# EAGLE design main (EAGLE 9.3.0)
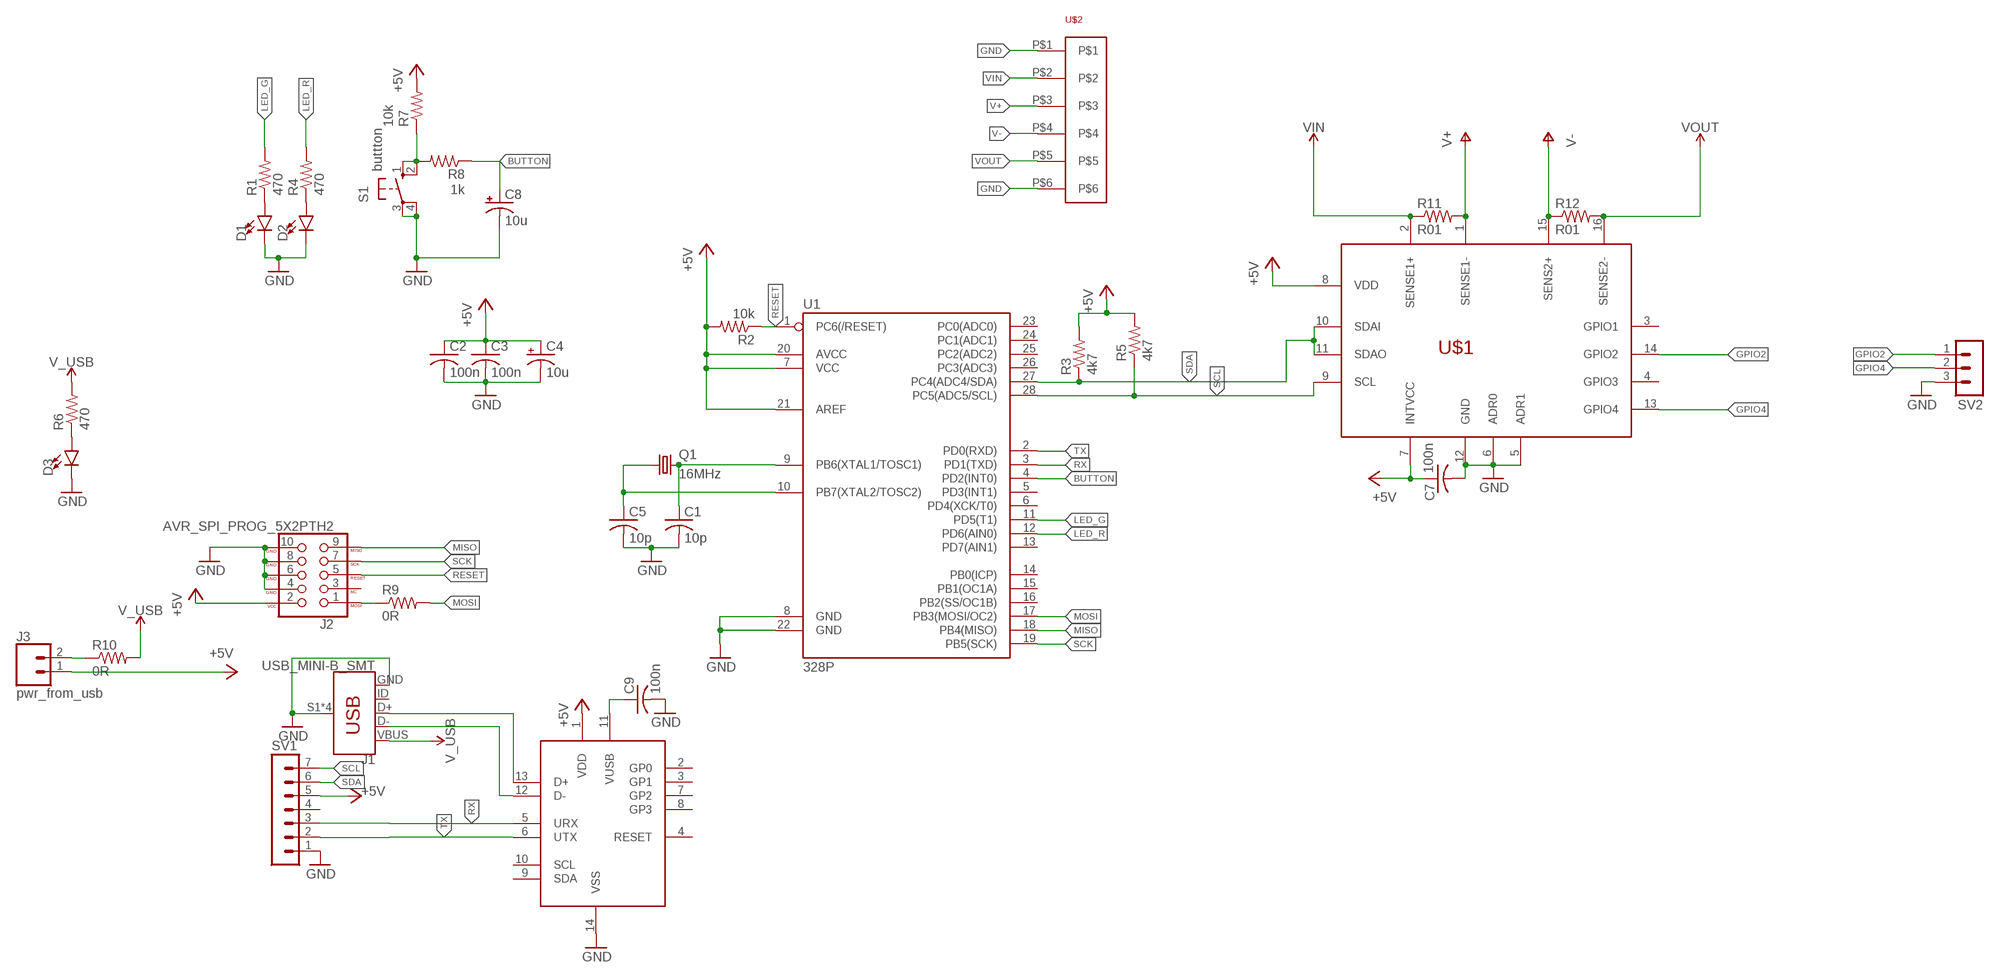
[diagram p0: schematic, sheet 1]

## Parts
BR1  MCP2221A  [DIP14]
C1  10p  C-USC0603  [C0603]
C2  100n  C-US050-030X075  [C050-030X075]
C3  100n  C-USC0805  [C0805]
C4  10u  CPOL-USE2,5-6E  [E2,5-6E]
C5  10p  C-USC0603  [C0603]
C7  100n  C-USC0805  [C0805]
C8  10u  CPOL-USE5-5  [E5-5]
C9  100n  C-US050-030X075  [C050-030X075]
D1  LED3MM  [LED_3MM]
D2  LED3MM  [LED_3MM]
D3  LED3MM  [LED_3MM]
J1  USB_MINI-B_SMT  [USB-MINIB]
J2  AVR_SPI_PROG_5X2PTH2  [2X5-SHROUDED]
J3  pwr_from_usb  CONN_02  [1X02]
Q1  16MHz  CRYSTALHC49U70  [HC49U70]
R1  470  R-US_R0805  [R0805]
R2  10k  R-US_0204/7  [0204/7]
R3  4k7  R-US_0207/10  [0207/10]
R4  470  R-US_R0805  [R0805]
R5  4k7  R-US_0207/10  [0207/10]
R6  470  R-US_R0805  [R0805]
R7  10k  R-US_R0805  [R0805]
R8  1k  R-US_R0805  [R0805]
R9  0R  R-US_0204/7  [0204/7]
R10  0R  R-US_0207/15  [0207/15]
R11  R01  R-US_R2512  [R2512]
R12  R01  R-US_R2512  [R2512]
S1  buttton  10-XX  [B3F-10XX]
SV1  MA07-1  [MA07-1]
SV2  MA03-1  [MA03-1]
U1  328P  ATMEGA328P_PDIP  [DIP28]
U$1  LTC2992  [MSOP16]
U$2  SCREWTERM_5MM_6WAY  [SCREWTERM_5MM_6WAY]

## Nets
+5V: BR1.1(VDD) C2.1 C3.1 C4.+ C7.1 J2.2(VCC) J3.1 R2.2 R3.2 R5.2 R7.2 SV1.5 U1.7(VCC) U1.20(AVCC) U1.21(AREF) U$1.7(INTVCC) U$1.8(VDD)
BUTTON: C8.+ R8.1 U1.4(PD2(INT0))
GND: BR1.14(VSS) C1.2 C2.2 C3.2 C4.- C5.2 C7.2 C8.- C9.2 D1.K(C) D2.K(C) D3.K(C) J1.GND J1.S1(SHIELD) J1.S2(SHIELD) J1.S3(SHIELD) J1.S4(SHIELD) J2.4(GND) J2.6(GND) J2.8(GND) J2.10(GND) S1.3(P) S1.4(P1) SV1.1 SV2.3 U1.8(GND) U1.22(GND) U$1.5(ADR1) U$1.6(ADR0) U$1.12(GND) U$2.P$1 U$2.P$6
GPIO2: SV2.1 U$1.14(GPIO2)
GPIO4: SV2.2 U$1.13(GPIO4)
LED_G: R1.2 U1.11(PD5(T1))
LED_R: R4.2 U1.12(PD6(AIN0))
MISO: J2.9(MISO) U1.18(PB4(MISO))
MOSI: R9.2 U1.17(PB3(MOSI/OC2))
N$1: C1.1 Q1.2 U1.9(PB6(XTAL1/TOSC1))
N$2: C5.1 Q1.1 U1.10(PB7(XTAL2/TOSC2))
N$3: D3.A R6.1
N$4: BR1.13(D+) J1.D+
N$5: BR1.12(D-) J1.D-
N$6: D2.A R4.1
N$7: R7.1 R8.2 S1.1(S) S1.2(S1)
N$8: D1.A R1.1
N$9: J2.1(MOSI) R9.1
N$10: BR1.11(VUSB) C9.1
N$11: J3.2 R10.1
RESET: J2.5(RESET) R2.1 U1.1(PC6(/RESET))
RX: BR1.5(URX) SV1.3 U1.3(PD1(TXD))
SCK: J2.7(SCK) U1.19(PB5(SCK))
SCL: R5.1 SV1.7 U1.28(PC5(ADC5/SCL)) U$1.9(SCL)
SDA: R3.1 SV1.6 U1.27(PC4(ADC4/SDA)) U$1.10(SDAI) U$1.11(SDAO)
TX: BR1.6(UTX) SV1.2 U1.2(PD0(RXD))
V+: R11.2 U$1.1(SENSE1-) U$2.P$3
V-: R12.1 U$1.15(SENS2+) U$2.P$4
V_USB: J1.VBUS R6.2 R10.2
VIN: R11.1 U$1.2(SENSE1+) U$2.P$2
VOUT: R12.2 U$1.16(SENSE2-) U$2.P$5
Unconnected: BR1.2(GP0) BR1.3(GP1) BR1.4(RESET) BR1.7(GP2) BR1.8(GP3) BR1.9(SDA) BR1.10(SCL) J1.ID J2.3(NC) SV1.4 U1.5(PD3(INT1)) U1.6(PD4(XCK/T0)) U1.13(PD7(AIN1)) U1.14(PB0(ICP)) U1.15(PB1(OC1A)) U1.16(PB2(SS/OC1B)) U1.23(PC0(ADC0)) U1.24(PC1(ADC1)) U1.25(PC2(ADC2)) U1.26(PC3(ADC3)) U$1.3(GPIO1) U$1.4(GPIO3)

## Library data of the parts
BR1 = 7_segment_lib:MCP2221A
C1-C3 C5 C7 C9 = rcl:C-US: CAPACITOR, American symbol; SPICEPREFIX: C
C4 C8 = rcl:CPOL-US: POLARIZED CAPACITOR, American symbol; SPICEPREFIX: C
D1-D3 = SparkFun-LED:LED: LED (Generic) Standard schematic elements and footprints for 5mm, 3mm, 1206, and 0603 sized LEDs. Generic LEDs with no color specified.; PROD_ID: DIO-08794
J1 = SparkFun-Connectors:USB_MINI-B: USB type Mini-B Connector Breaks out 5th pin, and includes shield pins if needed. SparkFun Products: SparkFun FTDI Basic Breakout <https://www.sparkfun.com/products/9716> SparkFun XBee Explorer USB <https://www.sparkfun.com/products/11812> SparkFun Redboard <https://www.sparkfun.com/products/12757>; PROD_ID: CONN-08193; SF_ID: PRT-00587
J2 = SparkFun-Connectors:AVR_SPI_PROG_5X2: AVR 10-pin ICSP Header This is the standard AVR In Circuit Serial Programming header. Minimal, but includes pin one indicator. Works with standard Olimex programmers. SparkFun Products: 2x5 AVR ICSP Male Header <https://www.sparkfun.com/products/778> - PTH 2x5 Pin Shrouded Header <https://www.sparkfun.com/products/8506> - PTH2; PROD_ID: CONN-08671; SF_ID: PRT-08506
J3 = SparkFun-Connectors:CONN_02: Multi connection point. Often used as Generic Header-pin footprint for 0.1 inch spaced/style header connections On any of the 0.1 inch spaced packages, you can populate with these: Break Away Headers - Straight <https://www.sparkfun.com/products/116> (PRT-00116) Break Away Male Headers - Right Angle <https://www.sparkfun.com/products/553> (PRT-00553) Female Headers <https://www.sparkfun.com/products/115> (PRT-00115) Break Away Headers - Machine Pin <https://www.sparkfun.com/products/117> (PRT-00117) Break Away Female Headers - Swiss Machine Pin <https://www.sparkfun.com/products/743> (PRT-00743) For SCREWTERMINALS and SPRING TERMINALS visit here: Screw Terimnals on SparkFun.com <https://www.sparkfun.com/search/results?term=Screw+Terminals> (5mm/3.5mm/2.54mm spacing) This device is also useful as a general connection point to wire up your design to another part of your project. Our various solder wires solder well into these plated through hole pads. Hook-Up Wire - Assortment (Stranded, 22 AWG) <https://www.sparkfun.com/products/11375> (PRT-11375) Hook-Up Wire - Assortment (Solid Core, 22 AWG) <https://www.sparkfun.com/products/11367> (PRT-11367) View the entire wire category on our website here <https://www.sparkfun.com/categories/141> Special notes: Molex polarized connector foot print use with: PRT-08233 with associated crimp pins and housings. 2.54_SCREWTERM for use with PRT-10571. 3.5mm Screw Terminal footprints for PRT-08084 5mm Screw Terminal footprints for use with PRT-08432
Q1 = crystal:CRYSTAL: CRYSTAL; OC_FARNELL: unknown; OC_NEWARK: unknown
R1-R12 = rcl:R-US_: RESISTOR, American symbol; SPICEPREFIX: R
S1 = DC_LOAD_AU:10-XX: OMRON SWITCH; MPN: B3F-1000; OC_FARNELL: 176432; OC_NEWARK: 36M3542
SV1 = con-lstb:MA07-1: PIN HEADER; OC_FARNELL: unknown; OC_NEWARK: unknown
SV2 = con-lstb:MA03-1: PIN HEADER; OC_FARNELL: unknown; OC_NEWARK: unknown
U1 = 7_segment_lib:ATMEGA328P_PDIP: Atmel 328P Through hole ATMEGA328P uC used in the Arduino 32kb flash, 1k EEPROM, 2k SRAM Datasheet <http://www.sparkfun.com/datasheets/Components/SMD/ATMega328.pdf> SparkFun Products Storefront component: AVR 28 Pin 20MHz 32K 6A/D - ATMega328P <https://www.sparkfun.com/products/9061> (COM-09061) SparkFun Simon Says - Through-Hole Soldering Kit <https://www.sparkfun.com/products/10547> (KIT-10547) SparkFun Learn to Solder - Simon Says <https://www.sparkfun.com/products/13708> (KIT-13708) SparkFun BigTime Watch Kit <https://www.sparkfun.com/products/11734> (KIT-11734) SparkFun ClockIt <https://www.sparkfun.com/products/10930> (KIT-10930) SparkFun Serial Enabled LCD Kit <https://www.sparkfun.com/products/10097> (LCD-10097) SparkFun Simon Tilts - Through Hole Soldering Kit <https://www.sparkfun.com/products/12634> (KIT-12634) SparkFun Frequency Counter Kit <https://www.sparkfun.com/products/10140> (KIT-10140) FabFM Radio Kit <https://www.sparkfun.com/products/11043> (KIT-11043) SparkFun Binary Blaster Kit <https://www.sparkfun.com/products/12037> (KIT-12037) SparkFun Metro-Gnome <https://www.sparkfun.com/products/9236> (KIT-09236) ATmega328 with Arduino Optiboot (Uno) <https://www.sparkfun.com/products/10524> (DEV-10524); PROD_ID: IC-09136
U$1 = 7_segment_lib:LTC2992
U$2 = 7_segment_lib:SCREWTERM_5MM_6WAY

## Board
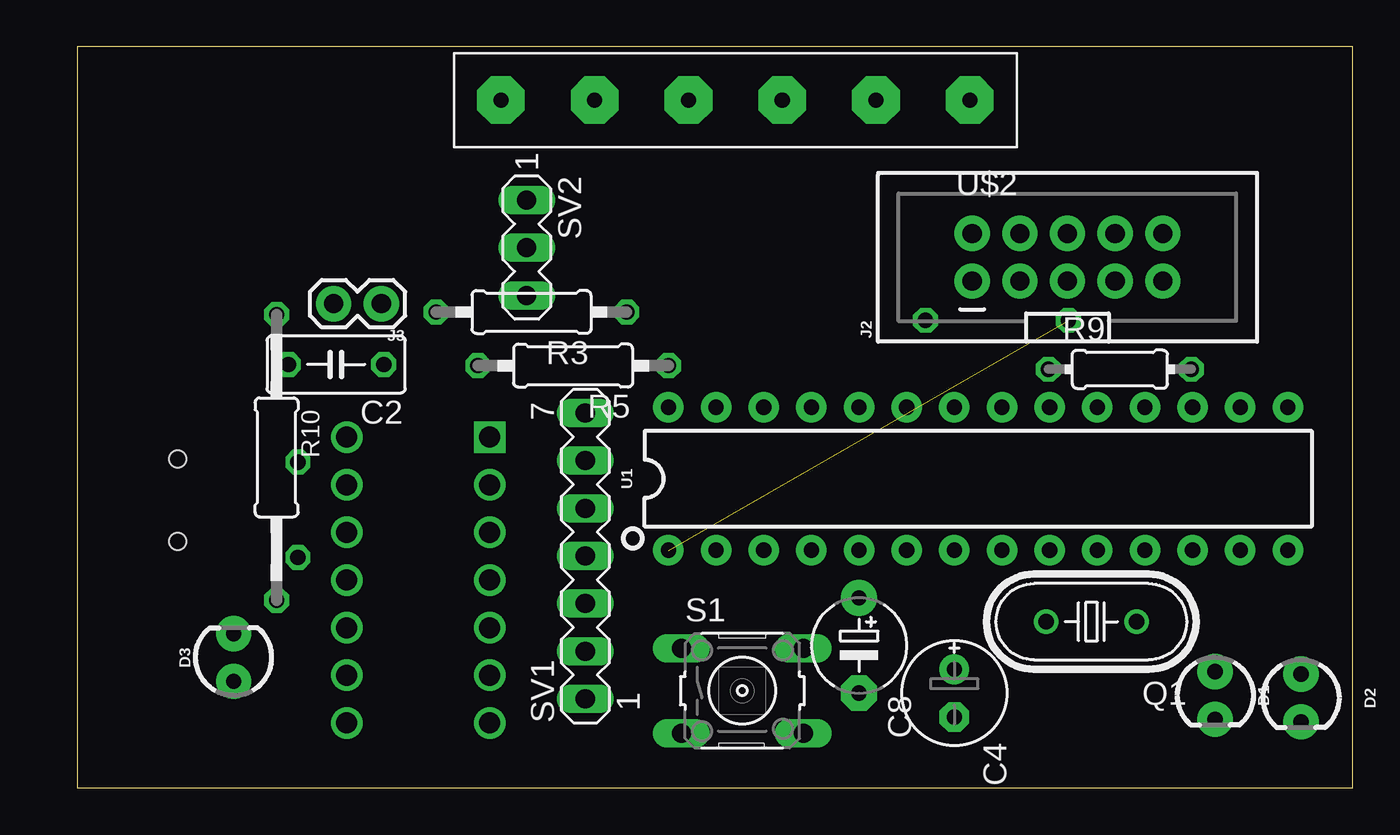
[diagram p1: board, top side]
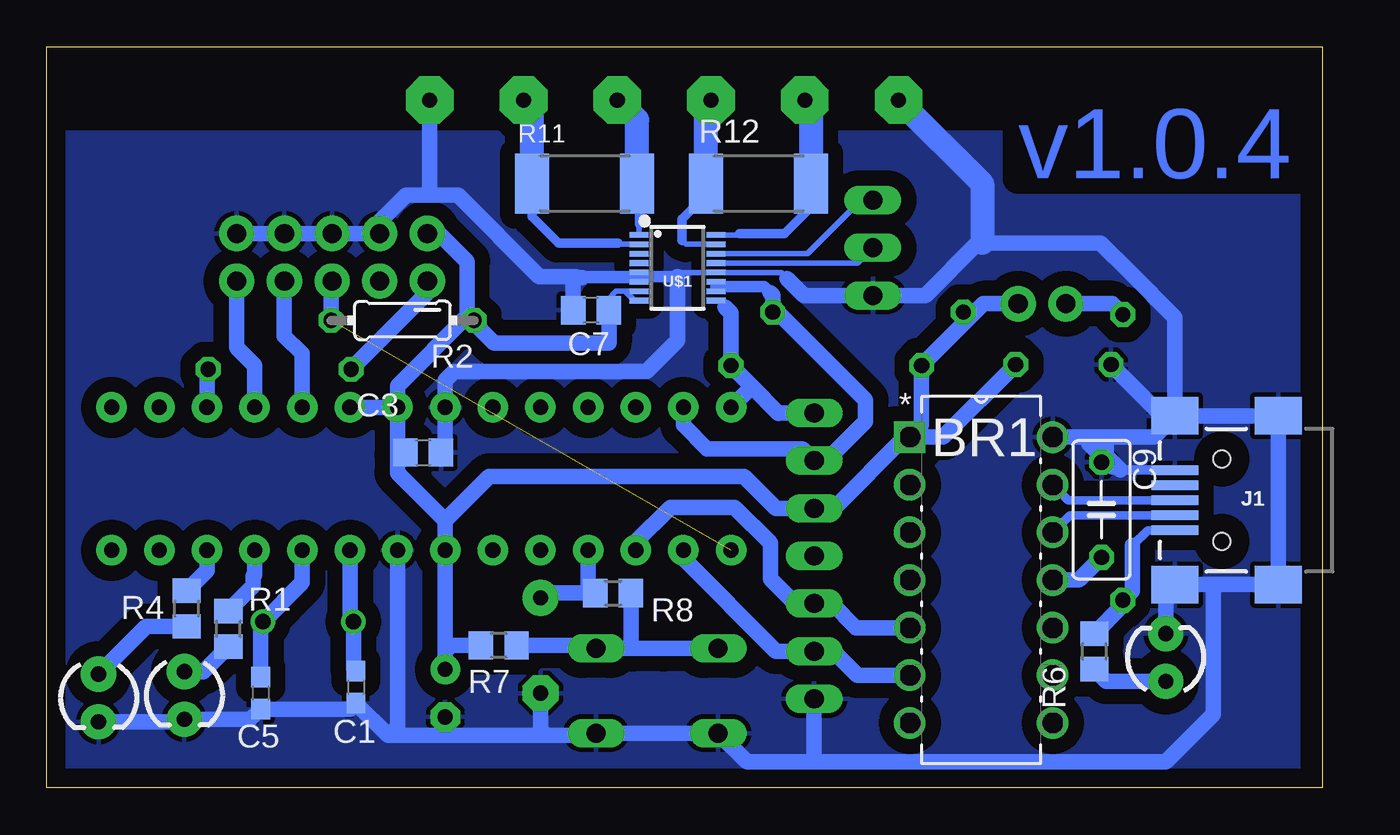
[diagram p2: board, bottom side, seen from below]

Size 68 x 39.5 mm. Coordinates in mm from the lower left corner, seen from the top.
Outline: 0,0 68,0 68,39.5 0,39.5 0,0
Copper layers (1*16): Top 0.035mm / dielectric 1.5mm / Bottom 0.035mm
Design rules "default": minimum track width 6mil, minimum drill 0.35mm, track to track 6mil, track to pad 6mil, pad to pad 6mil, via to via 6mil, smd to smd 6mil, copper to edge 40mil, drill to drill 6mil, minimum pad ring 10mil, minimum via ring 8mil, stop-mask expansion 4mil, vias tented up to drill 0mil, thermal gap 10mil

### Footprints (pad centres in the part's own frame; a part is rotated, then mirrored left to right if it is on the bottom)
DIP14 = drill 1.118 square: 1 -7.62,15.24 | drill 1.118: 2 -7.62,12.7; 3 -7.62,10.16; 4 -7.62,7.62; 5 -7.62,5.08; 6 -7.62,2.54; 7 -7.62,0; 8 0,0; 9 0,2.54; 10 0,5.08; 11 0,7.62; 12 0,10.16; 13 0,12.7; 14 0,15.24
C0603 = smd 1.1 x 1: 1 -0.85,0; 2 0.85,0
C050-030X075 = drill 0.813 octagon: 1 -2.54,0; 2 2.54,0
C0805 = smd 1.3 x 1.5: 1 -0.95,0; 2 0.95,0
E2,5-6E = drill 0.813 pad 1.575: + -1.27,0 | drill 0.813 pad 1.575 octagon: - 1.27,0
E5-5 = drill 0.813 pad 1.905: + -2.54,0 | drill 0.813 pad 1.905 octagon: - 2.54,0
LED_3MM = drill 0.813 pad 1.88: A -1.27,0; K 1.27,0
USB-MINIB = smd 2.5 x 0.5: D+ 2.5,0; D- 2.5,0.8; GND 2.5,-1.6; ID 2.5,-0.8; VBUS 2.5,1.6 | smd 2.5 x 2: S1 -3,4.5; S2 2.5,4.5; S3 -3,-4.5; S4 2.5,-4.5 | hole 0.9: 0,2.2; 0,-2.2
2X5-SHROUDED = drill 1.016 pad 1.88: 1 -1.27,5.08; 2 1.27,5.08; 3 -1.27,2.54; 4 1.27,2.54; 5 -1.27,0; 6 1.27,0; 7 -1.27,-2.54; 8 1.27,-2.54; 9 -1.27,-5.08; 10 1.27,-5.08
1X02 = drill 1.016 pad 1.88: 1 0,0; 2 2.54,0
HC49U70 = drill 0.813: 1 -2.413,0; 2 2.413,0
R0805 = smd 1.3 x 1.5: 1 -0.95,0; 2 0.95,0
0204/7 = drill 0.813 octagon: 1 -3.81,0; 2 3.81,0
0207/10 = drill 0.813 octagon: 1 -5.08,0; 2 5.08,0
0207/15 = drill 0.813 octagon: 1 -7.62,0; 2 7.62,0
R2512 = smd 1.8 x 3.2: 1 -2.8,0; 2 2.8,0
B3F-10XX = drill 1.016 long: 1 -3.251,2.261; 2 3.251,2.261; 3 -3.251,-2.261; 4 3.251,-2.261
MA07-1 = drill 1.016 long: 1 -7.62,0; 2 -5.08,0; 3 -2.54,0; 4 0,0; 5 2.54,0; 6 5.08,0; 7 7.62,0
MA03-1 = drill 1.016 long: 1 -2.54,0; 2 0,0; 3 2.54,0
DIP28 = drill 0.813 pad 1.626: 1 -16.51,-3.81; 2 -13.97,-3.81; 3 -11.43,-3.81; 4 -8.89,-3.81; 5 -6.35,-3.81; 6 -3.81,-3.81; 7 -1.27,-3.81; 8 1.27,-3.81; 9 3.81,-3.81; 10 6.35,-3.81; 11 8.89,-3.81; 12 11.43,-3.81; 13 13.97,-3.81; 14 16.51,-3.81; 15 16.51,3.81; 16 13.97,3.81; 17 11.43,3.81; 18 8.89,3.81; 19 6.35,3.81; 20 3.81,3.81; 21 1.27,3.81; 22 -1.27,3.81; 23 -3.81,3.81; 24 -6.35,3.81; 25 -8.89,3.81; 26 -11.43,3.81; 27 -13.97,3.81; 28 -16.51,3.81
MSOP16 = smd 0.3 x 1: 1 -1,-2.05; 2 -0.5,-2.05; 3 0,-2.05; 4 0.5,-2.05; 5 1,-2.05; 6 1.5,-2.05; 7 2,-2.05; 8 2.5,-2.05; 9 2.5,2.05; 10 2,2.05; 11 1.5,2.05; 12 1,2.05; 13 0.5,2.05; 14 0,2.05; 15 -0.5,2.05; 16 -1,2.05
SCREWTERM_5MM_6WAY = drill 0.8 pad 2.54 octagon: P$1 0,0; P$2 5,0; P$3 10,0; P$4 15,0; P$5 20,0; P$6 25,0

### Placement (x,y rotation side)
BR1  14.38,3.45 0 bottom
C1  51.53,5.36 270 bottom
C2  13.81,22.57 180 top
C3  47.94,17.87 0 bottom
C4  46.77,5.04 270 top
C5  56.61,5.04 270 bottom
C7  38.99,25.46 180 bottom
C8  41.69,7.58 270 top
C9  11.78,14.82 90 bottom
D1  60.67,4.91 270 top
D2  65.25,4.79 270 top
D3  8.35,6.95 90 top
J1  5.37,15.33 180 bottom
J2  52.8,28.28 90 top
J3  16.22,25.8 180 top
Q1  54.07,8.85 180 top
R1  58.32,8.47 90 bottom
R2  49.04,24.92 0 bottom
R3  24.23,25.36 180 top
R4  60.55,9.55 90 bottom
R5  26.45,22.5 180 top
R6  12.16,7.26 90 bottom
R7  43.91,7.58 180 bottom
R8  37.81,10.37 0 bottom
R9  55.59,22.31 0 top
R10  10.64,17.61 270 top
R11  39.34,32.22 0 bottom
R12  30.07,32.22 0 bottom
S1  35.46,5.17 0 top
SV1  27.1,12.36 90 top
SV2  23.97,28.79 270 top
U1  48.04,16.47 0 top
U$1  34.38,28.47 270 bottom
U$2  47.59,36.66 180 top

### Tracks (layer width: path | path; a pad name or v marks a point on that pad's centre or on a via)
+5V
  Bottom 0.305: U$1.7 37.18,26.47 | 37.18,26.47 37.66,26.47 38.04,26.09 C7.1 | U$1.8 36.68,25.97 37.18,26.47
  Bottom 0.813: U1.21 U1.20 | 46.77,7.26 U1.7 46.77,14.25 | 46.77,7.26 C4.+ | R7.2 46.45,7.58 46.77,7.26 | U1.21 49.31,17.74 | 49.31,17.74 49.31,16.79 46.77,14.25 | U1.21 49.31,21.42 45.59,25.14 | 45.59,25.14 45.59,28.06 47.09,29.55 J2.2 | C3.1 49.18,17.87 49.31,17.74 | J3.1 18.07,25.8 18.57,25.3 | 18.57,25.3 R5.2 21.37,19.33 BR1.1 | R3.2 19.08,25.3 18.57,25.3 | C2.1 20.22,18.69 BR1.1 | C7.1 38.04,23.71 44.16,23.71 45.59,25.14 | BR1.1 22.26,18.69 26.05,14.89 SV1.5 29.13,14.89 30.83,16.6 44.42,16.6 46.77,14.25 | R2.2 45.37,24.92 45.59,25.14
BUTTON
  Bottom 0.813: 41.37,10.43 C8.+ 41.43,10.37 R8.1 39.15,10.76 U1.4
GND
  Bottom 0.305: U$1.6 36.44,27.2 U$1.5 | 34.38,27.27 34.18,27.47 U$1.12 28.88,27.47 28.54,27.14
  Bottom 0.508: J1.GND 10.76,16.93 11.03,16.93 11.21,17.11
  Bottom 0.61: 39.47,27.2 36.44,27.2 | 34.38,27.27 39.81,27.27
  Bottom 0.813: J2.8 J2.4 50.26,30.19 48.86,31.58 47.59,31.58 | J2.8 J2.10 | J2.6 J2.8 | 41.37,2.78 46.77,2.78 | 46.77,2.78 49.8,2.78 | 49.8,2.78 C1.2 51.85,4.19 C5.2 57.16,3.64 D1.K 60.8,3.52 D2.K | C8.- 41.69,3.1 41.37,2.78 | C4.- 46.77,2.78 | 5.81,10.83 J1.S1 J1.S3 J1.S4 | J1.S4 9,18.69 11.53,18.69 | 11.53,18.69 12.48,18.69 | 12.48,18.69 BR1.14 | 11.21,17.11 11.81,17.71 | 11.81,17.71 12.48,18.38 12.48,18.69 | D3.K 8.35,10.38 8.31,10.38 7.99,10.7 | 27.09,1.38 27.53,1.38 30.69,1.38 S1.3 S1.4 38.84,2.78 41.37,2.78 | 27.09,1.38 8.35,1.38 5.81,3.92 5.81,10.7 5.81,10.83 | U1.8 49.31,3.27 49.8,2.78 | C3.2 46.77,18.09 U1.22 46.77,21.71 46.29,22.18 36.04,22.18 34.38,23.84 34.38,27.27 | 39.94,27.14 C7.2 | C9.2 11.78,17.68 11.81,17.71 | C2.2 8.53,19.83 J1.S4 | J1.S2 7.99,10.7 | J1.S2 7.99,10.7 | 5.81,10.83 J1.S2 | J1.S2 7.99,10.7 | J1.S4 7.87,25.08 10.28,27.49 11.83,29.04 18.13,29.04 18.38,29.04 21.18,26.25 SV2.3 27.65,26.25 28.54,27.14 | SV1.1 27.09,1.38 | 10.76,16.93 11.53,17.69 11.53,18.69 | 39.47,27.2 39.75,27.2 39.81,27.27 41.75,27.27 46.07,31.58 47.59,31.58 | U$2.P$1 47.59,31.58
  Bottom 1.27: U$2.P$6 18.13,32.2 18.13,29.04
  pour Bottom (isolate 0.813): 1.24,0.09 71.98,0.09 71.98,35.01 1.24,35.01
GPIO2
  Bottom 0.305: U$1.14 27.46,28.47 24.61,31.33 SV2.1
GPIO4
  Bottom 0.305: U$1.13 24.79,27.97 SV2.2
LED_G
  Bottom 0.813: R1.2 56.99,10.75 56.99,11.29 56.93,11.35 U1.11
LED_R
  Bottom 0.813: R4.2 59.47,11.58 U1.12
MISO
  Bottom 0.813: U1.18 56.93,22.5 57.88,23.45 J2.9
MOSI
  Bottom 0.813: U1.17 59.47,22.25 R9.2
N$1
  Bottom 0.813: C1.1 51.66,6.33 Q1.2 51.85,9.04 U1.9
N$2
  Bottom 0.813: C5.1 56.61,8.72 Q1.1 54.39,10.95 U1.10
N$3
  Bottom 0.813: D3.A 11.52,5.67 R6.1
N$4
  Bottom 0.457: J1.D+ 13.56,15.33 BR1.13
N$5
  Bottom 0.457: J1.D- 13.47,14.53 BR1.12
N$6
  Bottom 0.813: R4.1 62.7,8.6 D2.A
N$7
  Bottom 0.813: S1.1 35.15,7.43 36.8,7.43 | 36.8,7.43 S1.2 38.87,7.58 R7.1 | R8.2 36.86,7.49 36.8,7.43
N$8
  Bottom 0.813: D1.A 59.66,6.18 R1.1
N$9
  Bottom 0.813: J2.1 47.72,26.38 R9.1
N$10
  Bottom 0.813: C9.1 12.99,11.07 BR1.11
N$11
  Bottom 0.813: R10.1 11.21,25.8 J3.2
RESET  (1 unrouted)
  Bottom 0.813: R2.1 52.85,26.96 J2.5
RX
  Bottom 0.813: BR1.5 24.86,8.53 26.14,9.82 SV1.3 28.11,9.82 29.43,11.14 29.43,13.04 31.34,14.95 34.77,14.95 36.61,13.1 U1.3
SCK
  Bottom 0.813: J2.7 55.34,24.09 54.39,23.14 U1.19
SCL
  Bottom 0.305: U$1.9 32.2,25.97 31.84,25.61
  Bottom 0.813: 30.42,21.39 28.99,19.96 28.98,19.98 SV1.7 | 30.42,21.39 R5.1 31.53,25.3 31.84,25.61 | U1.28 30.42,21.39
SDA
  Bottom 0.305: U$1.11 32.34,26.73 32.34,26.57 U$1.10
  Bottom 0.61: 29.46,26.41 29.78,26.73 32.34,26.73
  Bottom 0.813: 29.46,26.41 29.3,26.25 R3.1 29.05,25.36 24.35,20.66 24.35,19.52 26.43,17.44 SV1.6 27.72,18.06 32.8,18.06 34.07,19.33 U1.27
TX
  Bottom 0.813: BR1.6 24.8,5.99 26.08,7.28 SV1.2 29.13,7.28 34.07,12.22 U1.2
V+
  Bottom 0.305: U$1.1 36.44,30.04 36.42,30.06
  Bottom 0.508: 36.42,30.06 36.42,32.1 R11.2
  Bottom 1.27: R11.2 36.54,35.61 U$2.P$3
V-
  Bottom 0.305: U$1.15 33.93,28.97 34.13,29.17
  Bottom 0.508: 34.13,29.17 34.13,30.31 32.87,31.58 R12.1
  Bottom 1.27: R12.1 32.87,36.39 U$2.P$4
V_USB
  Bottom 0.457: 10.13,12.91 9.32,13.73 J1.VBUS
  Bottom 0.813: R6.2 10.64,9.74 R10.2 10.13,10.5 10.13,12.91
VIN
  Bottom 0.305: U$1.2 37.49,28.97 37.56,29.04
  Bottom 0.508: 37.56,29.04 40.73,29.04 42.14,30.45 R11.1
  Bottom 1.27: R11.1 42.14,36.21 U$2.P$2
VOUT
  Bottom 0.305: U$1.16 31.16,29.47 31.08,29.55
  Bottom 0.508: 31.08,29.55 28.67,29.55 27.27,30.95 R12.2
  Bottom 1.27: U$2.P$5 27.27,36.34 R12.2

### Text on the board
Bottom: v1.0.4